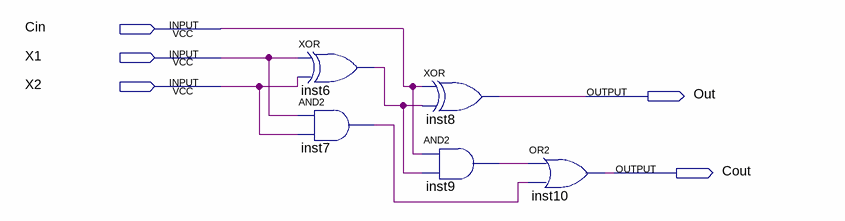
[diagram p0: schematic sheet]
// Quartus schematic Somador.bdf as structural Verilog: 5 symbols, 5 pins
module Somador (
  input  Cin,
  input  X1,
  input  X2,
  output Out,
  output Cout
);

  wire inst6_out, inst7_out, inst9_out;

  xor inst6 (inst6_out, X1, X2);
  and inst7 (inst7_out, X1, X2);
  xor inst8 (Out, Cin, inst6_out);
  and inst9 (inst9_out, Cin, inst6_out);
  or inst10 (Cout, inst9_out, inst7_out);
endmodule
